# EAGLE schematic air-sensors (EAGLE 6.6.0)
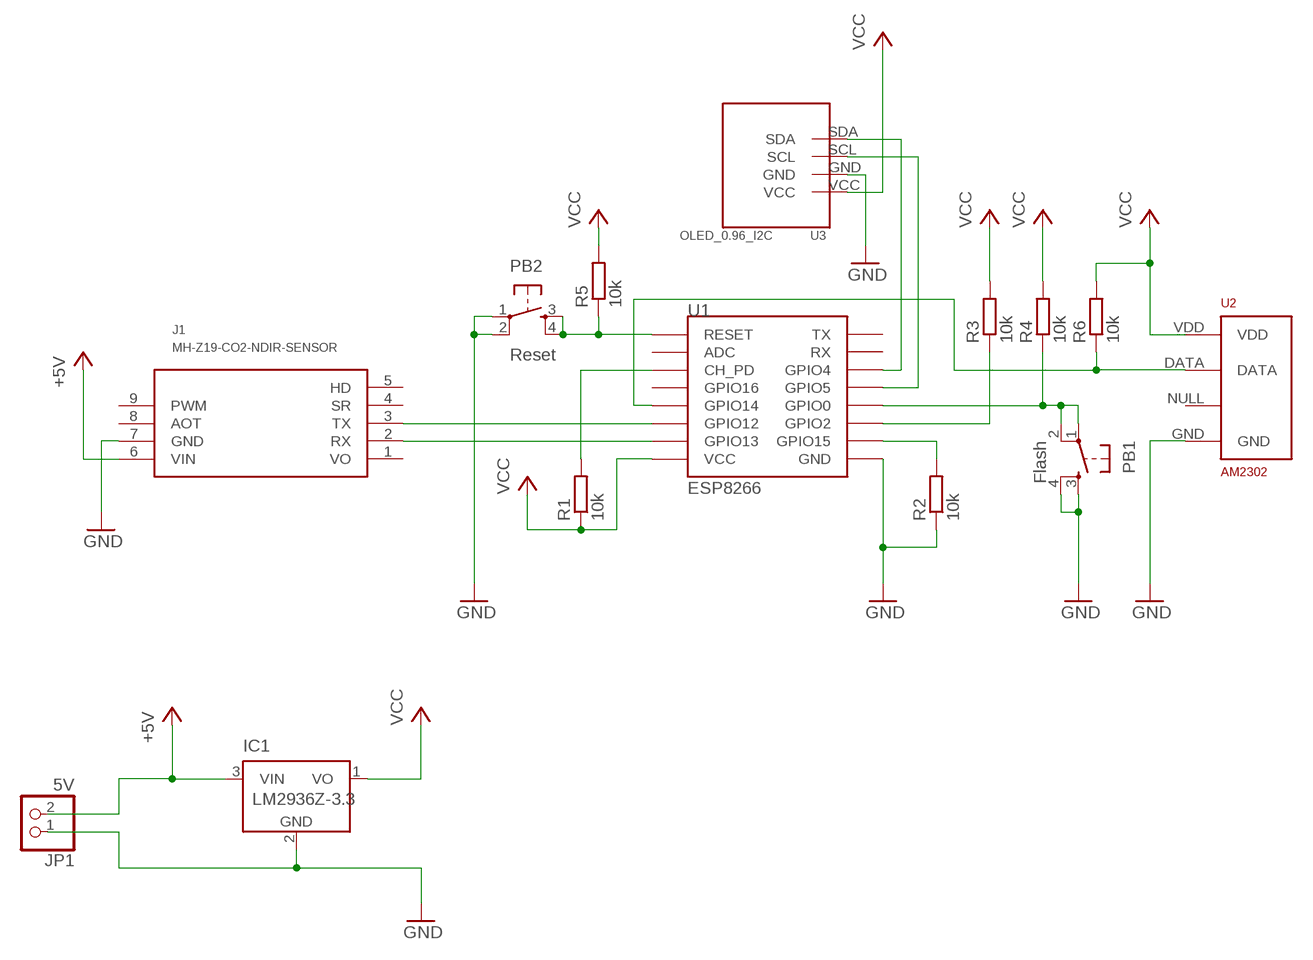
[diagram p0: schematic, sheet 1]

## Parts
IC1  LM2936Z-3.3  [TO92]
J1  MH-Z19-CO2-NDIR-SENSOR  [MH-Z19]
JP1  5V  PINHD-1X2  [1X02]
PB1  Flash  TAC_SWITCHPTH  [TACTILE-PTH]
PB2  Reset  TAC_SWITCHPTH  [TACTILE-PTH]
R1  10k  R-EU_0204/7  [0204/7]
R2  10k  R-EU_0204/7  [0204/7]
R3  10k  R-EU_0204/7  [0204/7]
R4  10k  R-EU_0204/7  [0204/7]
R5  10k  R-EU_0204/7  [0204/7]
R6  10k  R-EU_0204/7  [0204/7]
U1  ESP8266  ESP12  [ESP12]
U2  AM2302  RHT03_DHT-22_AM2302  [RHT03_DHT-22]
U3  OLED_0.96_I2C  [OLED_0.96_I2C]

## Nets
+5V: IC1.3(VIN) J1.6(VIN) JP1.2
GND: IC1.2(GND) J1.7(GND) JP1.1 PB1.3 PB1.4 PB2.1 PB2.2 R2.1 U1.GND U2.GND U3.GND
N$1: R1.2 U1.CH_PD
N$2: R2.2 U1.GPIO15
N$3: PB2.3 PB2.4 R5.1 U1.RESET
N$4: R3.1 U1.GPIO2
N$5: J1.3(TX) U1.GPIO12
N$6: PB1.1 PB1.2 R4.1 U1.GPIO0
N$7: R6.1 U1.GPIO14 U2.DATA
N$8: J1.2(RX) U1.GPIO13
N$9: U1.GPIO4 U3.SDA
N$11: U1.GPIO5 U3.SCL
VCC: IC1.1(VO) R1.1 R3.2 R4.2 R5.2 R6.2 U1.VCC U2.VDD U3.VCC
Unconnected: J1.4(SR) J1.5(HD) J1.8(AOT) J1.9(PWM) U1.ADC U1.GPIO16 U1.RX U1.TX U2.NULL

## Power pins joined to a net without a drawn wire
VO: J1.1(VO)

## Library data of the parts
IC1 = national-semiconductor:LM2936?*: Ultra-Low Quiescent Current LDO Voltage Regulator Source: Data sheet <http://www.national.com/ds/LM/LM2936.pdf>; MF: NATIONAL SEMICONDUCTOR; MPN: LM2936Z-3.3/NOPB; OC_FARNELL: 1564641; OC_NEWARK: 41K4532
J1 = mh-z19:MH-Z19: MH-Z19 - CO2 NDIR SENSOR
JP1 = pinhead:PINHD-1X2: PIN HEADER
PB1 PB2 = IceMan:TAC_SWITCH: Momentary Switch Button commonly used for reset or general input. Spark Fun Electronics SKU : COM-00097
R1-R6 = IceMan:R-EU_: RESISTOR, European symbol
U1 = esp8266modules:ESP12: ESP8266 Wifi module 12
U2 = RHT03_DHT-22_AM2302:RHT03_DHT-22_AM2302: RHT03 / DHT-22 / AM2302 Packages and symbol for the RHT03 / DHT-22 relative humidity and temperature sensor. Note: The AM2302 is a wired version of the DHT-22 which typically requires less clearance and is thus provided as a separate package.; PROD_ID: SEN-10167
U3 = tft_1.8_1.44_oled_0.96:OLED_0.96_I2C